# EasyEDA Pro project Frogduino Atmega1284 R2 EasyEDA Model.epro

# Schematic Schematic2
Board Name: PCB6; Create Date: 2026-05-09; Page Name: P1; Project Name: FrogduinoR2; Schematic Name: Schematic2; Update Date: 2026-05-13; Company: EasyEDA.com; Page Size: A4; Version: V1.0
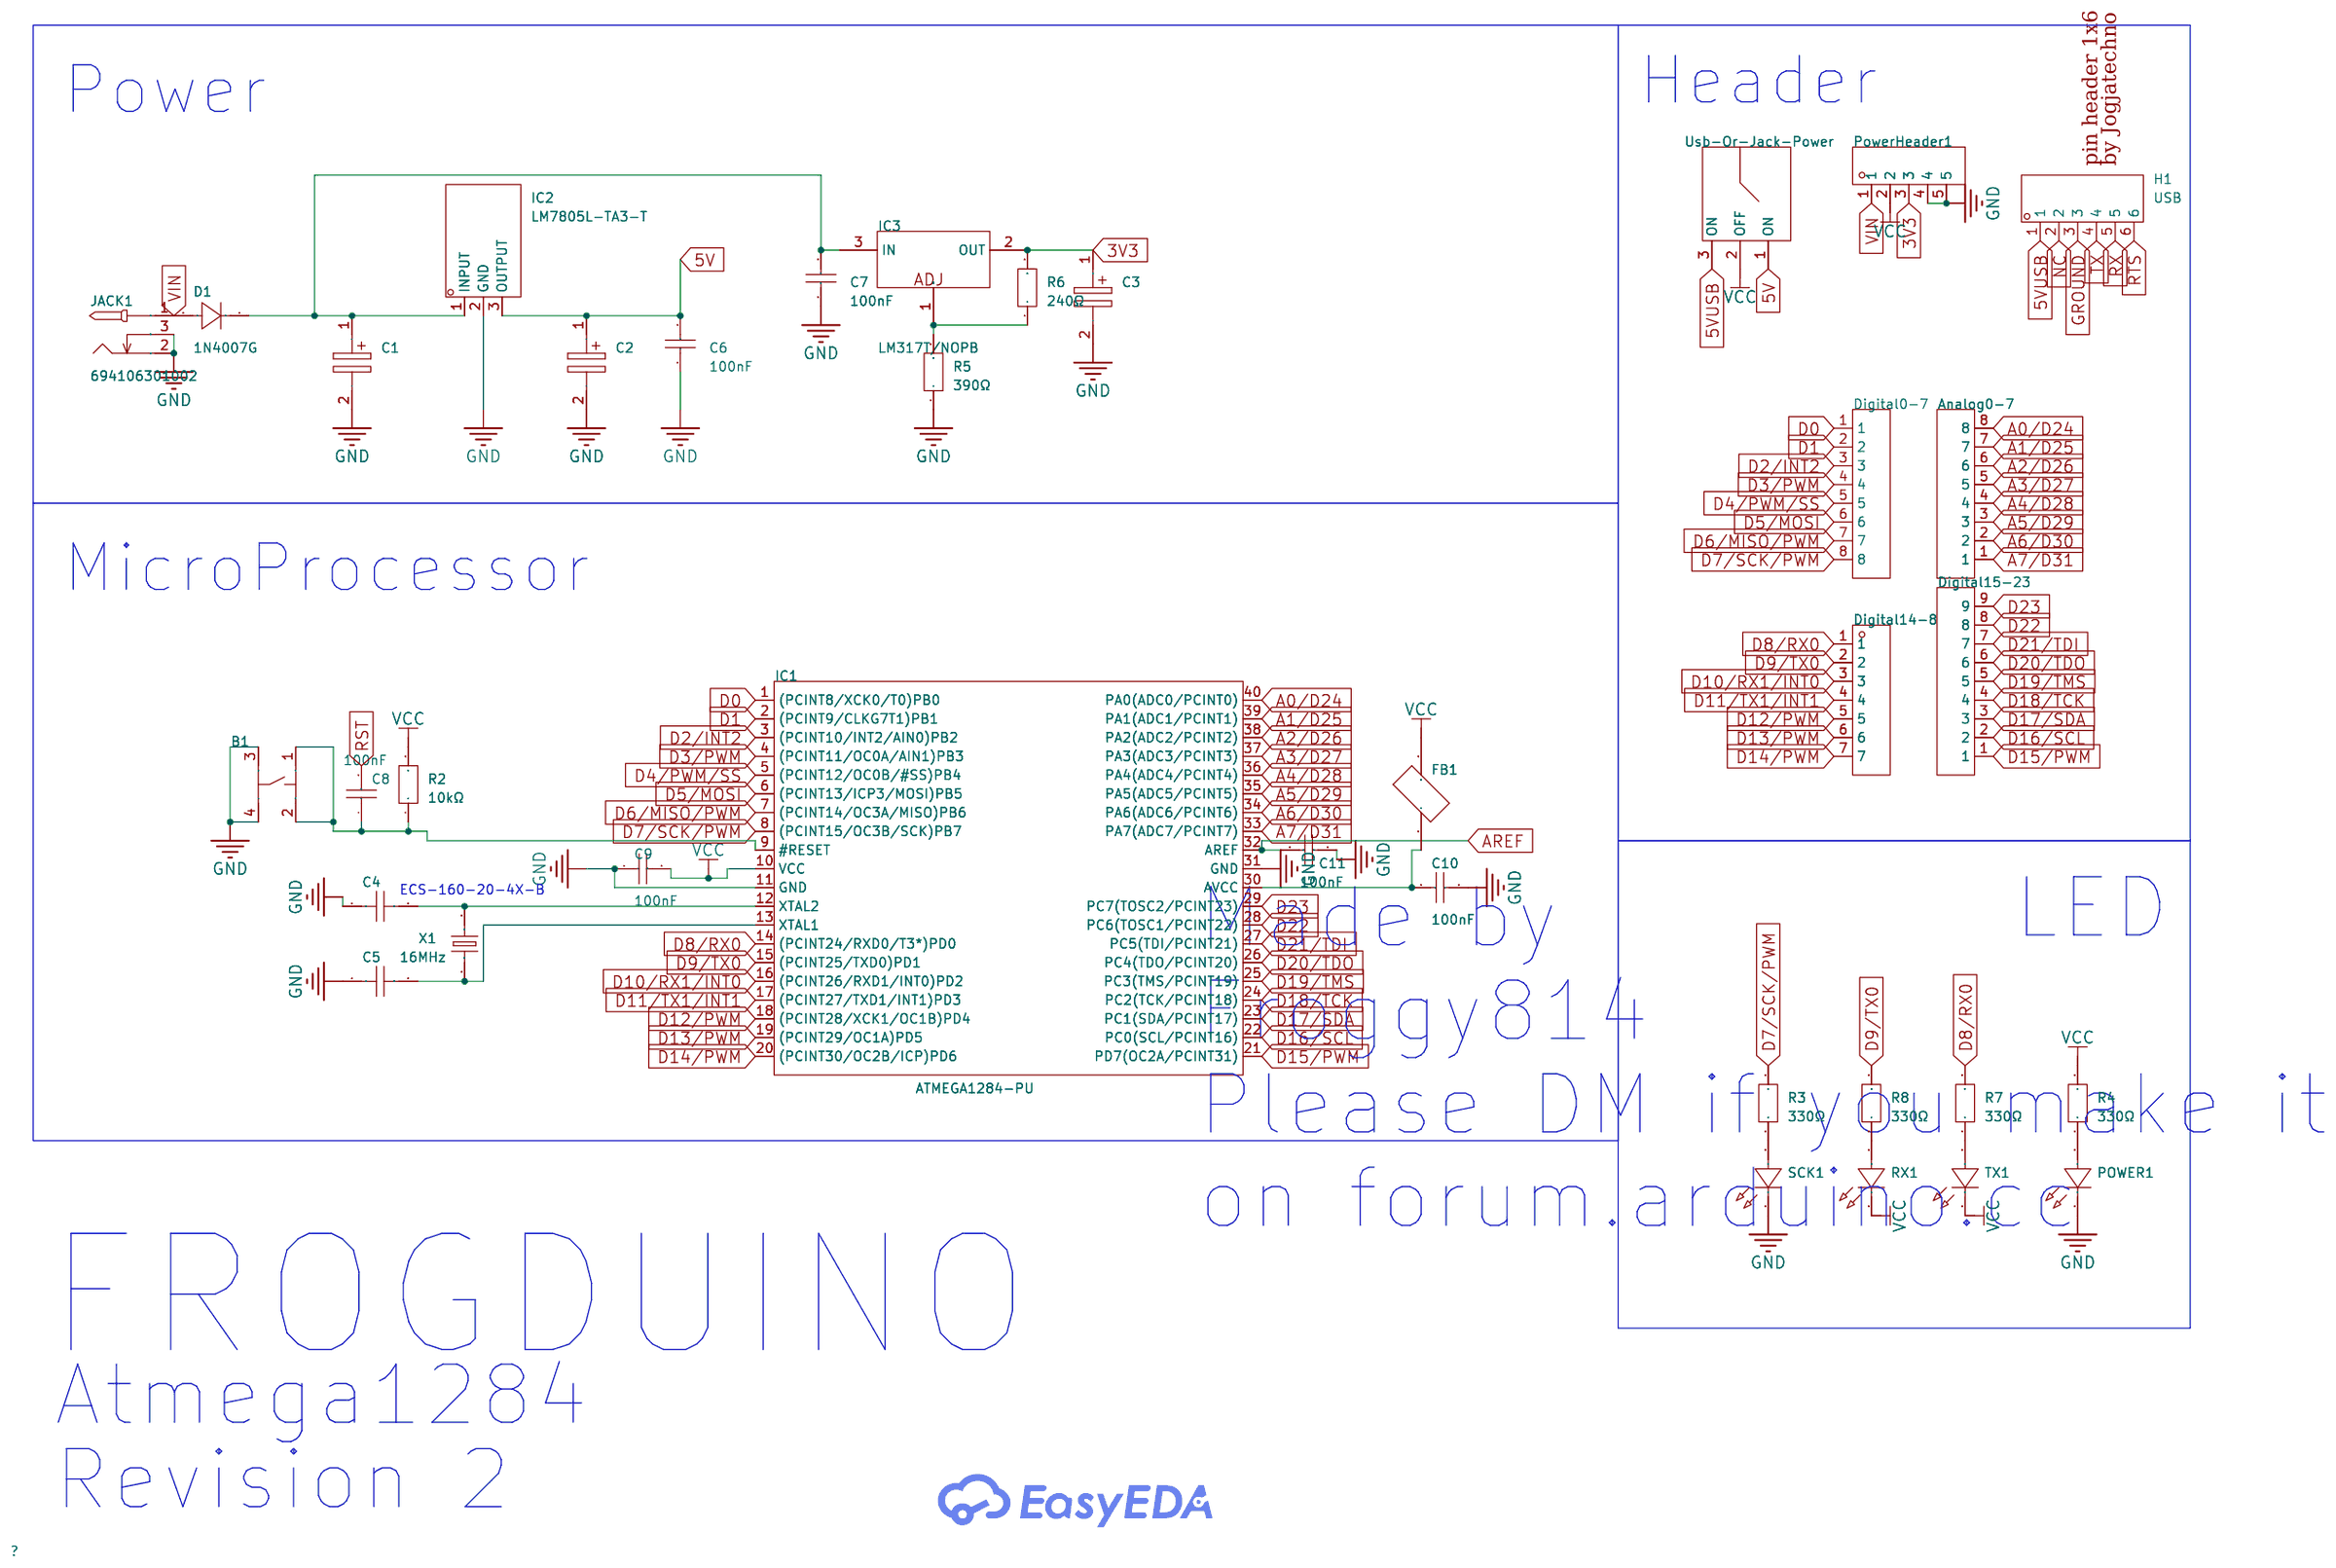
[diagram p0: schematic sheet]

## Parts
Analog0-7  排母HDR1X8-2.54  [HDR-TH_8P-P2.54-V-F]
B1  TS02-66-43-BK-100-SCR-D  [SW-TH_4P-L6.0-W6.0-P4.50-LS6.5]
C1  -  [CAPPM7344X310N]
C2  -  [CAPPM7344X310N]
C3  -  [CAPPM7344X310N]
C4  C0805C220J4HACTU  [C1210]
C5  C0805C220J4HACTU  [C1210]
C6  100nF  [C1206]
C7  100nF  [C1206]
C8  100nF  [C1206]
C9  100nF  [C1206]
C10  100nF  [C1206]
C11  100nF  [C1206]
D1  1N4007G  [DO-41_BD2.4-L4.7-P8.70-D0.6-RD]
Digital0-7  排母HDR1X8-2.54  [HDR-TH_8P-P2.54-V-F]
Digital14-8  2.54-1*7P/30mm(3+24+3)  [HDR-TH_7P-P2.54-V-M-1]
Digital15-23  KH-2.54PH180-1X9P-L11.5  [HDR-TH_9P-P2.54-V-M]
FB1  -  [FB_28L0138-70R-10]
H1  USB
IC1  ATMEGA1284-PU  [CONN-SMD_40P-P2.54_C9900007166]
IC2  LM7805L-TA3-T  [TO-220IS_L10.16-W4.7-P2.54-L]
IC3  LM317T/NOPB  [TO-220-3_L10.2-W4.6-P2.54-L]
JACK1  694106301002  [CONN-TH_694106301002]
POWER1  SML-811UTT86C  [LED-SMD_L3.4-W1.3-RD]
PowerHeader1  2.54mm1*5PHeader  [HDR-TH_5P-P2.54-V]
R2  10kΩ  [R2512]
R3  330Ω  [R2010]
R4  330Ω  [R2010]
R5  390Ω  [R2512]
R6  240Ω  [R2512]
R7  330Ω  [R2010]
R8  330Ω  [R2010]
RX1  SML-811UTT86C  [LED-SMD_L3.4-W1.3-RD]
SCK1  SML-811UTT86C  [LED-SMD_L3.4-W1.3-RD]
TX1  SML-811UTT86C  [LED-SMD_L3.4-W1.3-RD]
Usb-Or-Jack-Power  pu-mts-103 ON-OFF-ON  [SW-TH_MTS-103]
X1  16MHz  [HC-49US_L11.5-W4.5-P4.88]

## Library data of the parts
Analog0-7 Digital0-7 = 排母HDR1X8-2.54: Supplier Part: C9900015386; Supplier Footprint: HDR1X8-2.54; JLCPCB Part Class: Extended Part; Supplier: LCSC
B1 = TS02-66-43-BK-100-SCR-D: Circuit:SPST Actuator Style:Round Button Operating Force:1N Mounting Type:Through Hole Contact Current:50mA Voltage Rating:12V IP Rating:- Termination Style:PC Pin Life:100,000 Cycles Operating Temperature:-30℃~+80℃ Operating Temperature:-30℃~+80℃; Supplier Part: C4364877; Manufacturer: CUI; Supplier Footprint: 插件; JLCPCB Part Class: Extended Part; Datasheet: https://item.szlcsc.com/datasheet/TS02-66-43-BK-100-SCR-D/4935791.html; Supplier: LCSC; Circuit: SPST; Actuator Style: Round Button; Operating Force: 1N; Mounting Type: Through Hole; Contact Current: 50mA; Voltage Rating: 12V; Termination Style: PC Pin; Life: 100,000 Cycles; Operating Temperature: -30℃~+80℃
C1-C3 = TAJD107K016SNJV_
C4 C5 = C1210C220J5GACTU: Supplier Part: C22570112; Datasheet: https://atta.szlcsc.com/upload/public/pdf/source/20241203/850095265084969892AAA77F7FD49452.pdf; Supplier: LCSC
C6-C11 = 1206B104K101CT: Capacitance:100nF Tolerance:±10% Tolerance:±10% Voltage Rating:100V Temperature Coefficient:X7R; LCSC Part Name: 100nF ±10% 100V; Supplier Part: C77502; Manufacturer: Walsin(华新科); Supplier Footprint: 1206; JLCPCB Part Class: Extended Part; Datasheet: https://item.szlcsc.com/datasheet/1206B104K101CT/78631.html; Supplier: LCSC; Tolerance: ±10%; Voltage Rating: 100V; Temperature Coefficient: X7R
D1 = 1N4007G: Diode Configuration: Forward Voltage (Vf@If):1.1V@1A Reverse Voltage (Vr): Average Rectified Current (Io): Reverse Leakage Current:5uA@1kV; LCSC Part Name: 电压:1kV 电流:1A; Supplier Part: C2764732; Supplier Footprint: DO-41; JLCPCB Part Class: Extended Part; Supplier: LCSC; Forward Voltage (Vf@If): 1.1V@1A; Reverse Leakage Current: 5uA@1kV
Digital14-8 = 2.54-1*7P/30mm(3+24+3): Supplier Part: C9900034497; Supplier Footprint: 2.54-1x7P; JLCPCB Part Class: Extended Part; Supplier: LCSC
Digital15-23 = KH-2.54PH180-1X9P-L11.5: Pin Structure:1x9P Pitch:2.54mm Row Spacing:- Circluar Pins/Square Pins:Policy Mounting Type:Straight Number of Rows:Single Row Number of Pins:9P Current Rating:3A Voltage Rating (Max):- Length of Mating Pin:6mm Insulation Height:2.5mm Length of End Conne; LCSC Part Name: 1x9P 间距:2.54mm 方针 直插; Supplier Part: C2932701; Manufacturer: kinghelm(金航标); Supplier Footprint: 插件,P=2.54mm; JLCPCB Part Class: Extended Part; Datasheet: https://atta.szlcsc.com/upload/public/pdf/source/20211220/F957F65180C658B5F5CB9573E63AB667.pdf; Supplier: LCSC; Pin Structure: 1x9P; Pitch: 2.54mm; Circluar Pins/Square Pins: Policy; Mounting Type: Straight; Number of Rows: Single Row; Number of Pins: 9P; Current Rating: 3A; Length of Mating Pin: 6mm; Insulation Height: 2.5mm; Length of End Connection Pin: 3mm; Operating Temperature: -40℃~+105℃; Color: Black
FB1 = 28L0138-70R-10_
H1 = Headers  Pins1x6P 2.54mm: Supplier Part: C54102; Supplier: LCSC; Manufacturer: ReliaPro; image: http://image.lceda.cn/szlcsc/C54102.jpg
IC1 = ATMEGA1284-PU: CPU Core:AVR CPU Maximum Speed:20MHz Program Storage Size:128KB Program Memory Type:FLASH EEPROM:4KB Number of I/O:32 ADC (Bit):10bit Voltage - Supply:1.8V~5.5V Voltage - Supply:1.8V~5.5V Applications:-; Supplier Part: C1341589; Manufacturer: MICROCHIP(美国微芯); Supplier Footprint: PDIP-40; Datasheet: https://atta.szlcsc.com/upload/public/pdf/source/20210630/C1341589_4A9698A644C701E681E776C28A22DCFA.pdf; Supplier: LCSC; CPU Core: AVR; CPU Maximum Speed: 20MHz; Program Storage Size: 128KB; Program Memory Type: FLASH; EEPROM: 4KB; Number of I/O: 32; ADC (Bit): 10bit; Voltage - Supply: 1.8V~5.5V
IC2 = LM7805L-TA3-T: Output Type:-; Supplier Part: C340686; Supplier Footprint: TO-220IS; JLCPCB Part Class: Extended Part; Supplier: LCSC
IC3 = LM317T/NOPB: Output Type:Adjustable Voltage - Supply:40V Output Voltage:1.25V~37V Output Voltage:1.25V~37V Output Current:1.5A Power Supply Rejection Ratio (PSRR):80dB@(120Hz) Voltage Dropout:- standby current:50uA Noise:- Features:Over Current Protection；Short Circui; LCSC Part Name: 1.25V~37V 1.5A 40V; Supplier Part: C2870516; Manufacturer: TI(德州仪器); Supplier Footprint: TO-220; JLCPCB Part Class: Extended Part; Datasheet: https://www.ti.com/cn/lit/gpn/lm117; Supplier: LCSC; Output Type: Adjustable; Voltage - Supply: 40V; Output Voltage: 1.25V~37V; Output Current: 1.5A; Power Supply Rejection Ratio (PSRR): 80dB@(120Hz); standby current: 50uA; Features: Over Current Protection；Short Circuit Protection；Over Temperature Protection; Operating Temperature: 0℃~+125℃@(Tj); Output Configuration: Positive; Number of Outputs: 1
JACK1 = 694106301002: link: https://cn.bing.com/search?q=datasheet： 694106301002; Supplier: Digi-Key; Supplier Part: C9900003330; JLCPCB Part Class: Extended Part; Manufacturer: würth Elektronik
POWER1 RX1 SCK1 TX1 = SML-811UTT86C: Illumination Color:Red Voltage - Forward(Vf):1.95V Voltage - Forward(Vf):1.95V Forward Current:10mA Wavelength - Dominant:620nm Wavelength - Dominant:620nm Lens Color:Water Clear Luminous Intensity:22.4mcd Luminous Intensity:22.4mcd; Supplier Part: C5924201; Manufacturer: ROHM(罗姆); Supplier Footprint: SMD,3.4x1.3mm; JLCPCB Part Class: Extended Part; Datasheet: https://item.szlcsc.com/datasheet/SML-811UTT86C/6861401.html; Supplier: LCSC; Illumination Color: Red; Voltage - Forward(Vf): 1.95V; Forward Current: 10mA; Wavelength - Dominant: 620nm; Lens Color: Water Clear; Luminous Intensity: 22.4mcd
PowerHeader1 = 2.54mm 1*5P Header: Supplier Part: C50951; Supplier: LCSC; Manufacturer: ReliaPro; image: http://image.lceda.cn/szlcsc/C50951.jpg
R2 = AS25J1002ET: Type:Thick Film Resistor Resistance:10kΩ Tolerance:±5% Tolerance:±5% Power(Watts):1.5W Temperature Coefficient:±100ppm/℃ Temperature Coefficient:±100ppm/℃ Operating Temperature:-55℃~+155℃ Operating Temperature:-55℃~+155℃; LCSC Part Name: 厚膜电阻 10kΩ ±5% 1.5W; Supplier Part: C3954599; Manufacturer: Ohmite; Supplier Footprint: 2512; Datasheet: https://item.szlcsc.com/datasheet/AS25J1002ET/4523159.html; Supplier: LCSC; Type: Thick Film Resistor; Tolerance: ±5%; Power(Watts): 1.5W; Temperature Coefficient: ±100ppm/℃; Operating Temperature: -55℃~+155℃
R3 R4 R7 R8 = RC2010JK-07330RL: Type:Thick Film Resistors Resistance: Tolerance:±5% Tolerance:±5% Power(Watts): Overload Voltage (Max): Temperature Coefficient:±100ppm/℃ Temperature Coefficient:±100ppm/℃ Operating Temperature Range:-55℃~+155℃ Operating Temperature Range:-55℃~+155℃; LCSC Part Name: 厚膜电阻 330Ω ±5% 750mW; Supplier Part: C375684; Manufacturer: YAGEO(国巨); Supplier Footprint: 2010; JLCPCB Part Class: Extended Part; Datasheet: https://atta.szlcsc.com/upload/public/pdf/source/20190227/C375684_4A58F674F4E48E69DECCBC420C92B96E.pdf; Supplier: LCSC; Type: Thick Film Resistors; Tolerance: ±5%; Temperature Coefficient: ±100ppm/℃; Operating Temperature Range: -55℃~+155℃
R5 = CRGP2512F390R: Type:Thick Film Resistors Resistance: Tolerance:±1% Tolerance:±1% Power(Watts): Temperature Coefficient:±100ppm/℃ Temperature Coefficient:±100ppm/℃ Operating Temperature Range:-55℃~+155℃ Operating Temperature Range:-55℃~+155℃; LCSC Part Name: 厚膜电阻 390Ω ±1% 2W; Supplier Part: C4323717; Manufacturer: TE Connectivity(泰科电子); Supplier Footprint: 2512; Supplier: LCSC; Type: Thick Film Resistors; Tolerance: ±1%; Temperature Coefficient: ±100ppm/℃; Operating Temperature Range: -55℃~+155℃
R6 = RK73H3ATTE2400F: Type:Thick Film Resistor Resistance:240Ω Tolerance:±1% Tolerance:±1% Power(Watts):1W Temperature Coefficient:±100ppm/℃ Temperature Coefficient:±100ppm/℃ Operating Temperature:-55℃~+155℃ Operating Temperature:-55℃~+155℃; LCSC Part Name: 厚膜电阻 240Ω ±1% 1W; Supplier Part: C346146; Manufacturer: KOA; Supplier Footprint: 2512; Datasheet: https://item.szlcsc.com/datasheet/RK73H3ATTE2400F/322812.html; Supplier: LCSC; Type: Thick Film Resistor; Tolerance: ±1%; Power(Watts): 1W; Temperature Coefficient: ±100ppm/℃; Operating Temperature: -55℃~+155℃
Usb-Or-Jack-Power = pu-mts-103 ON-OFF-ON: Supplier Part: C9900183726; Supplier Footprint: Through hole; JLCPCB Part Class: Extended Part; Supplier: LCSC
X1 = XIHCELNANF-16MHZ: Type:Through-Hole Crystal Oscillator Frequency:16MHz Normal temperature Frequency Tolerance:±30ppm Normal temperature Frequency Tolerance:±30ppm Load Capacitance:20pF Frequency Stability:±30ppm Frequency Stability:±30ppm Operating Temperature:-40℃~+85℃ Op; LCSC Part Name: 16MHz ±30ppm 20pF; Supplier Part: C295075; Manufacturer: TAITIEN(泰艺电子); Supplier Footprint: HC-49S; JLCPCB Part Class: Extended Part; Datasheet: https://atta.szlcsc.com/upload/public/pdf/source/20190107/C358649_B3943D1FEB8737E4FCE005A191A94016.pdf; Supplier: LCSC; Type: Through-Hole Crystal Oscillator; Normal temperature Frequency Tolerance: ±30ppm; Load Capacitance: 20pF; Frequency Stability: ±30ppm; Operating Temperature: -40℃~+85℃

## Nets
3V3: C3.1(+) IC3.2(OUT) PowerHeader1.3 R6.2
5V: C2.1(+) C6.2 IC2.3(OUTPUT) Usb-Or-Jack-Power.1(ON)
5VUSB: H1.1 Usb-Or-Jack-Power.3(ON)
GND: B1.3 B1.4 C1.2(-) C2.2(-) C3.2(-) C4.1 C5.1 C6.1 C7.1 C9.1 C10.2 C11.2 IC1.11(GND) IC1.31(GND) IC2.2(GND) JACK1.2 JACK1.3 POWER1.1(K) PowerHeader1.4 PowerHeader1.5 R5.1 SCK1.1(K)
VCC: C9.2 FB1.2 IC1.10(VCC) PowerHeader1.2 R2.2 R4.2 RX1.1(K) TX1.1(K) Usb-Or-Jack-Power.2(OFF)
VIN: D1.2(A) JACK1.1 PowerHeader1.1
A0/D24: Analog0-7.8 IC1.40(PA0(ADC0/PCINT0))
A1/D25: Analog0-7.7 IC1.39(PA1(ADC1/PCINT1))
A2/D26: Analog0-7.6 IC1.38(PA2(ADC2/PCINT2))
A3/D27: Analog0-7.5 IC1.37(PA3(ADC3/PCINT3))
A4/D28: Analog0-7.4 IC1.36(PA4(ADC4/PCINT4))
A5/D29: Analog0-7.3 IC1.35(PA5(ADC5/PCINT5))
A6/D30: Analog0-7.2 IC1.34(PA6(ADC6/PCINT6))
A7/D31: Analog0-7.1 IC1.33(PA7(ADC7/PCINT7))
AREF: C11.1 IC1.32(AREF)
D0: Digital0-7.1 IC1.1((PCINT8/XCK0/T0)PB0)
D1: Digital0-7.2 IC1.2((PCINT9/CLKG7T1)PB1)
D2/INT2: Digital0-7.3 IC1.3((PCINT10/INT2/AIN0)PB2)
D3/PWM: Digital0-7.4 IC1.4((PCINT11/OC0A/AIN1)PB3)
D4/PWM/SS: Digital0-7.5 IC1.5((PCINT12/OC0B/#SS)PB4)
D5/MOSI: Digital0-7.6 IC1.6((PCINT13/ICP3/MOSI)PB5)
D6/MISO/PWM: Digital0-7.7 IC1.7((PCINT14/OC3A/MISO)PB6)
D7/SCK/PWM: Digital0-7.8 IC1.8((PCINT15/OC3B/SCK)PB7) R3.2
D8/RX0: Digital14-8.1 IC1.14((PCINT24/RXD0/T3*)PD0) R7.2
D9/TX0: Digital14-8.2 IC1.15((PCINT25/TXD0)PD1) R8.2
D10/RX1/INT0: Digital14-8.3 IC1.16((PCINT26/RXD1/INT0)PD2)
D11/TX1/INT1: Digital14-8.4 IC1.17((PCINT27/TXD1/INT1)PD3)
D12/PWM: Digital14-8.5 IC1.18((PCINT28/XCK1/OC1B)PD4)
D13/PWM: Digital14-8.6 IC1.19((PCINT29/OC1A)PD5)
D14/PWM: Digital14-8.7 IC1.20((PCINT30/OC2B/ICP)PD6)
D15/PWM: Digital15-23.1 IC1.21(PD7(OC2A/PCINT31))
D16/SCL: Digital15-23.2 IC1.22(PC0(SCL/PCINT16))
D17/SDA: Digital15-23.3 IC1.23(PC1(SDA/PCINT17))
D18/TCK: Digital15-23.4 IC1.24(PC2(TCK/PCINT18))
D19/TMS: Digital15-23.5 IC1.25(PC3(TMS/PCINT19))
D20/TDO: Digital15-23.6 IC1.26(PC4(TDO/PCINT20))
D21/TDI: Digital15-23.7 IC1.27(PC5(TDI/PCINT21))
D22: Digital15-23.8 IC1.28(PC6(TOSC1/PCINT22))
D23: Digital15-23.9 IC1.29(PC7(TOSC2/PCINT23))
GROUND: H1.3
NC: H1.2
RST: C8.2
RTS: H1.6
RX: H1.5
TX: H1.4
Net-(B1-1): B1.1 B1.2 C8.1 IC1.9(#RESET) R2.1
Net-(C1-1): C1.1(+) C7.2 D1.1(K) IC2.1(INPUT) IC3.3(IN)
Net-(C4-2): C4.2 IC1.12(XTAL2) X1.2
Net-(C5-2): C5.2 IC1.13(XTAL1) X1.1
Net-(C10-1): C10.1 FB1.1 IC1.30(AVCC)
Net-(IC3-1): IC3.1(ADJ) R5.2 R6.1
Net-(POWER1-2): POWER1.2(A) R4.1
Net-(R3-1): R3.1 SCK1.2(A)
Net-(R7-1): R7.1 TX1.2(A)
Net-(R8-1): R8.1 RX1.2(A)

## Notes on the sheet
- Power
- Header
- MicroProcessor
- ECS-160-20-4X-B
- LED
- Made by
  Froggy814
  Please DM if you make it
  on forum.arduino.cc
- FROGDUINO
- Atmega1284
- Revision 2

# Board PCB6
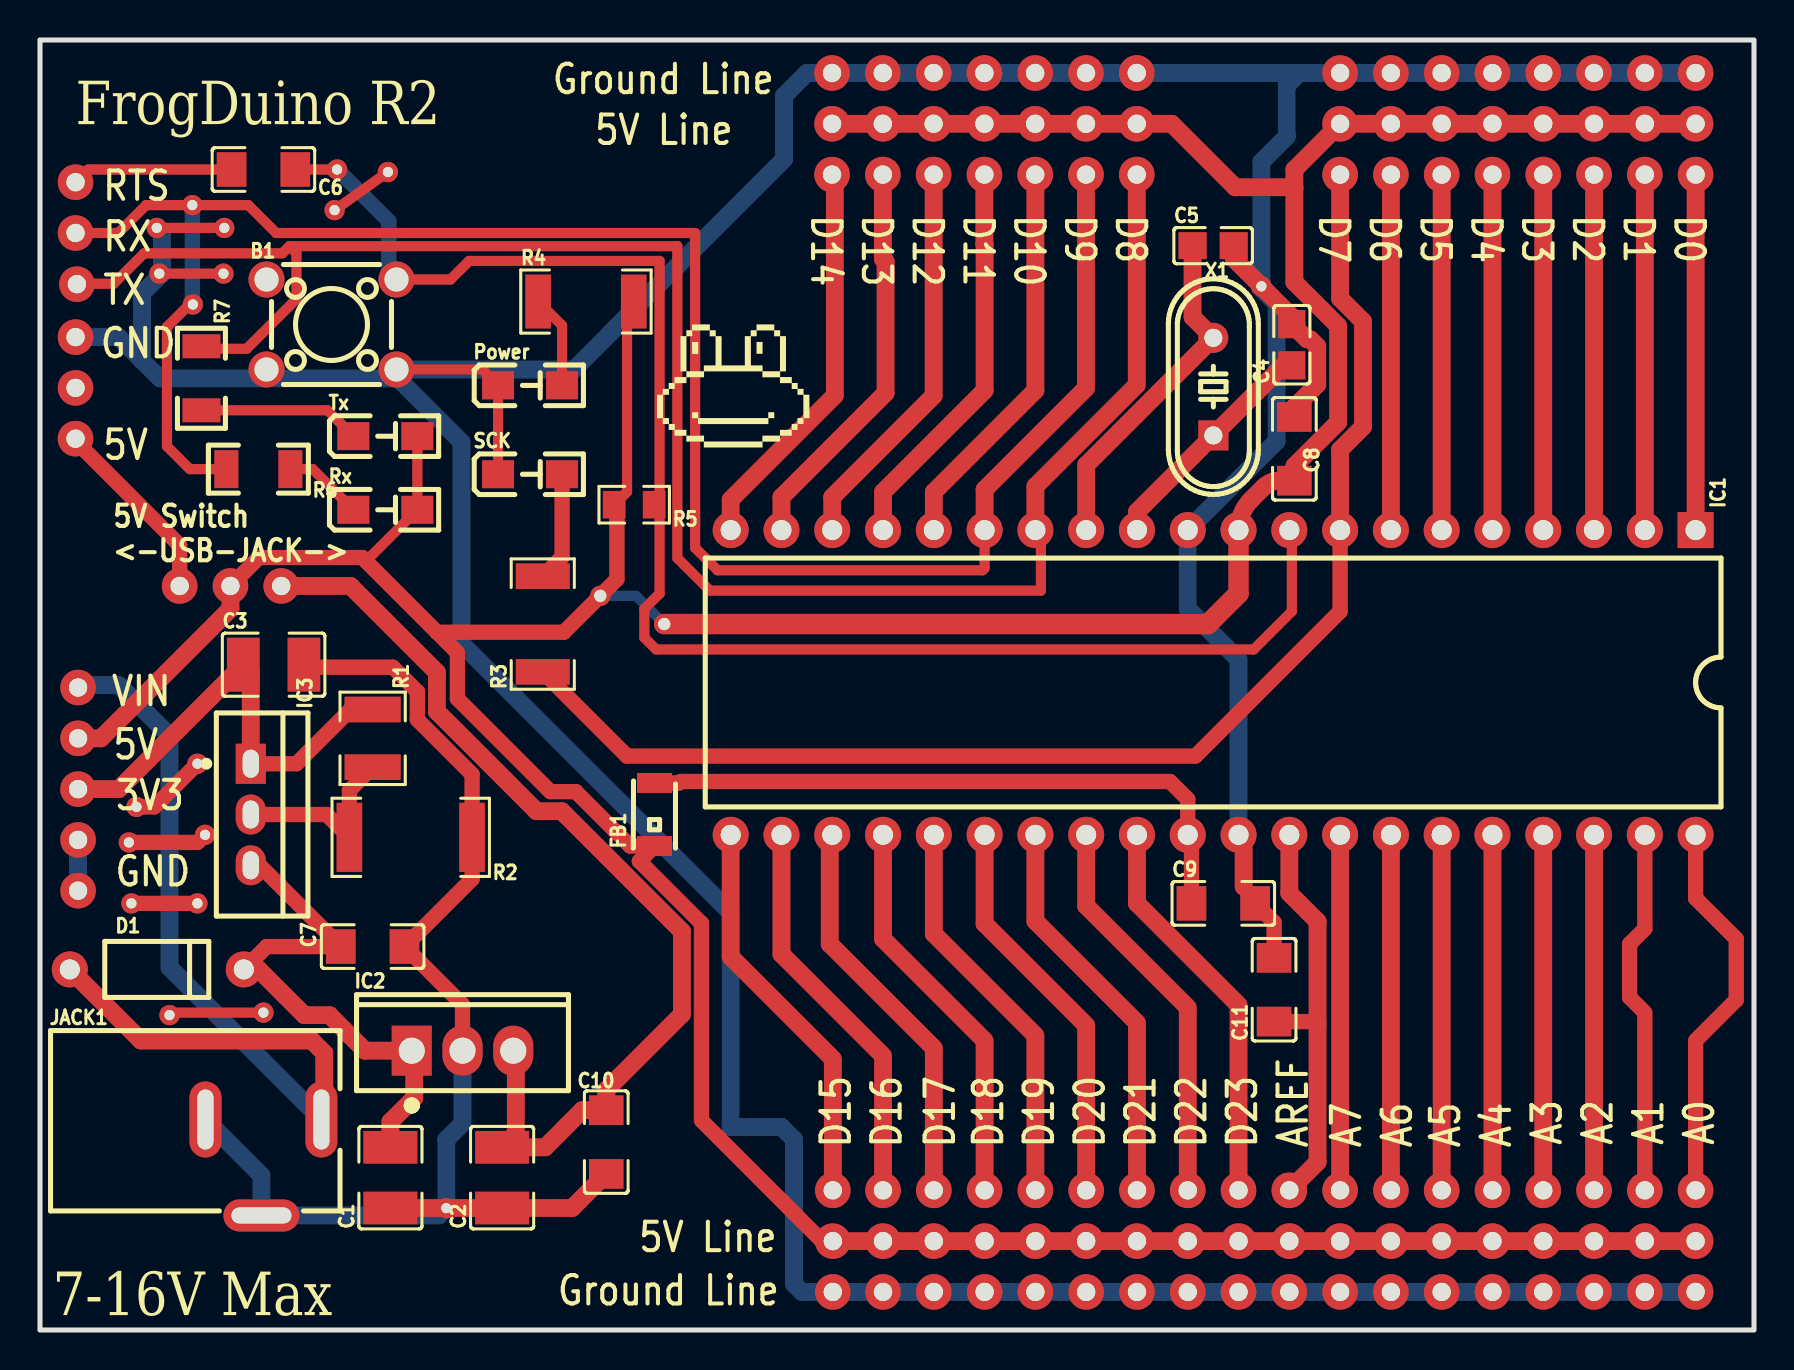
[diagram p1: board, top side]
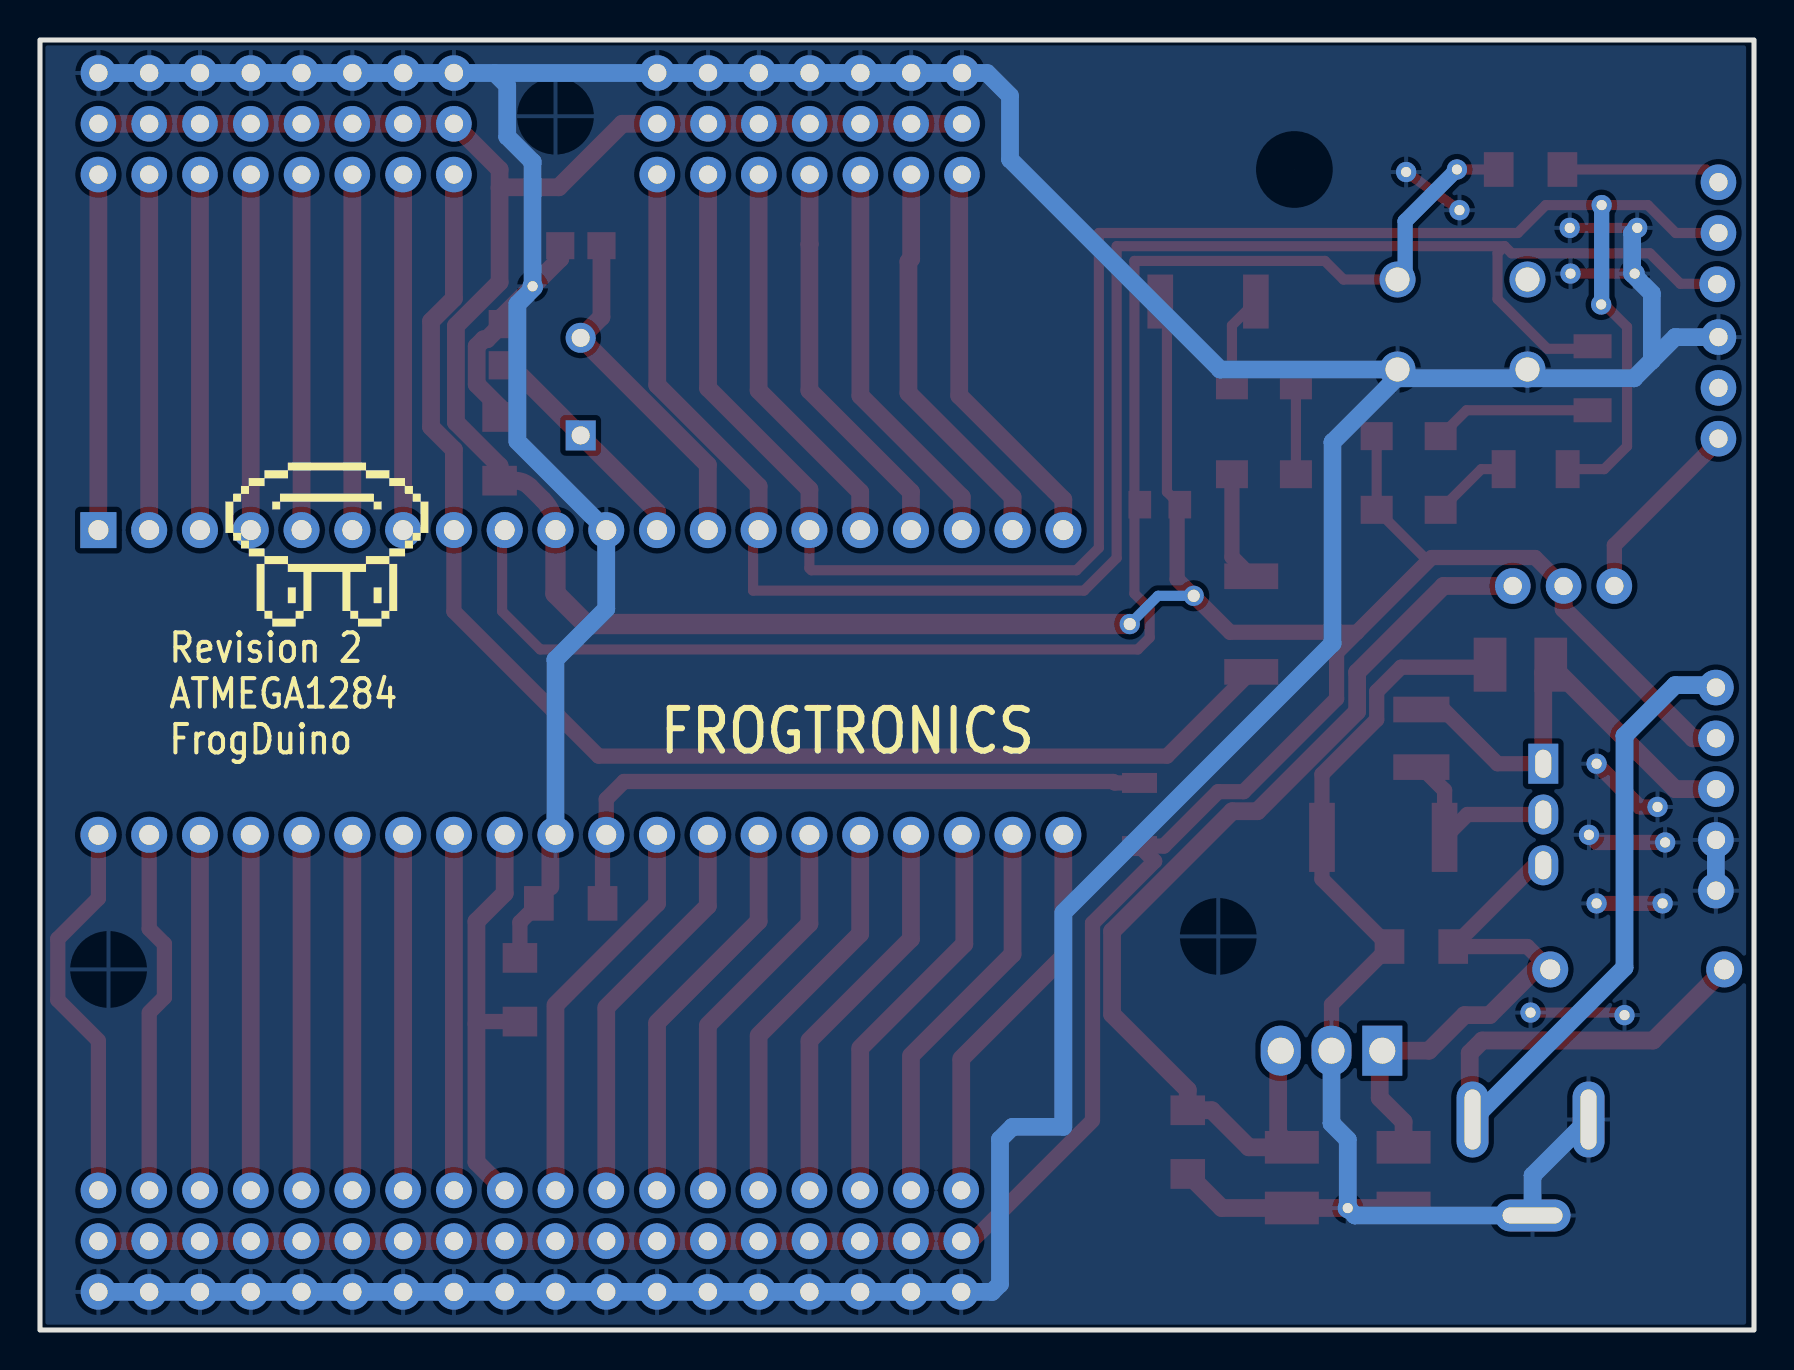
[diagram p2: board, bottom side, seen from below]

Outline 85.72 x 64.52 mm; copper layers: Top Layer, Bottom Layer. Coordinates in mm from the lower left corner of the outline.
Outline path: rectangle 0,64.52 85.72,0
Stack: Top Layer 0.035mm / Dielectric1 1.51mm FR4 er 4.5 / Bottom Layer 0.035mm

## Design rules (mm)
template: Custom Config
spacing copperThickness1oz (default): track to track 0.152, other pairs 0.152 to 0.3
spacing copperThickness2oz: track to track 0.203, other pairs 0.152 to 0.3
track width copperThickness1oz (default): min 0.254, default 0.508, max 5.08
track width copperThickness2oz: min 0.203, default 0.254, max 2.54
differential pair differentialPair (default): width min 0.127, default 0.254, max 2.54; gap min 0.152, default 0.152
via viaSize (default): diameter min 0.508, default 1.016, max 15.24; hole min 0.254, default 0.508, max 10.16

## Placement (name value [footprint] x y rotation side)
B1  TS02-66-43-BK-100-SCR-D  [SW-TH_4P-L6.0-W6.0-P4.50-LS6.5]  14.58 50.29 0 top
C1  -  [C1210]  17.53 7.62 90 top
C2  -  [C1210]  23.11 7.62 90 top
C3  -  [C1210]  11.68 33.27 0 top
C4  C0805C220J4HACTU  [C0805]  62.61 49.28 90 top
C5  C0805C220J4HACTU  [C0805]  58.67 54.23 0 top
C6  100nF  [C1206]  11.18 58.04 180 top
C7  100nF  [C1206]  16.64 19.18 180 top
C8  100nF  [C1206]  62.74 44.07 90 top
C9  100nF  [C1206]  59.18 21.34 0 top
C10  100nF  [C1206]  28.32 9.4 90 top
C11  100nF  [C1206]  61.72 17.02 90 top
D1  1N4007G  [DO-41_BD2.4-L4.7-P8.70-D0.9-RD]  5.84 18.03 180 top
FB1  2450AT18A100E  [ANT-SMD_L3.2-W1.6]  30.73 25.78 90 top
IC1  ATMEGA1284-PU  [PDIP-40_L52.3-W13.8-P2.54-LS15.2-BL]  58.67 32.38 180 top
IC2  LM7805L-TA3-T  [TO-220IS_L10.16-W4.7-P2.54-L]  21.13 13.97 0 top
IC3  LM317T/NOPB  [TO-220-3_L10.2-W4.6-P2.54-L]  10.54 25.78 270 top
JACK1  694106301002  [DC-IN-TH_694106301002]  11.18 8.13 0 top
NOREF  -  [Pad_e180]  22.99 58.04 0 top
NOREF#2  -  [Pad_e1841]  65.02 4.44 0 top
NOREF#3  -  [Pad_e1862]  75.18 1.91 0 top
NOREF#4  -  [Pad_e1842]  67.56 4.44 0 top
NOREF#5  -  [Pad_e6892]  28.02 36.72 0 top
NOREF#6  -  [Pad_e1855]  57.4 1.91 0 top
NOREF#7  -  [Pad_e2027]  67.56 62.86 0 top
NOREF#8  -  [Pad_e8725]  82.3 18.03 0 top
NOREF#9  -  [Pad_e15]  75.18 57.78 0 top
NOREF#10  -  [Pad_e2016]  77.72 60.32 0 top
NOREF#11  -  [Pad_e2022]  47.23 62.86 0 top
NOREF#12  -  [Pad_e435]  6.98 37.21 90 top
NOREF#13  -  [Pad_e1847]  80.26 4.44 0 top
NOREF#14  -  [Pad_e55]  54.86 6.98 0 top
NOREF#15  -  [Pad_e1607]  7.64 51.29 0 top
NOREF#16  -  [Pad_e14]  77.72 57.78 0 top
NOREF#17  -  [Pad_e48]  80.26 6.98 0 top
NOREF#18  -  [Pad_e5832]  8.25 24.76 0 top
NOREF#19  -  [Pad_e1863]  77.72 1.91 0 top
NOREF#20  -  [Pad_e2028]  70.1 62.86 0 top
NOREF#21  -  [Pad_e342]  39.61 57.78 0 top
NOREF#22  -  [Pad_e1865]  82.8 1.91 0 top
NOREF#23  -  [Pad_e46]  75.18 6.98 0 top
NOREF#24  -  [Pad_e1839]  59.94 4.44 0 top
NOREF#25  -  [Pad_e2010]  54.85 60.32 0 top
NOREF#26  -  [Pad_e1623]  20.32 6.1 0 top
NOREF#27  -  [Pad_e43]  70.1 6.98 0 top
NOREF#28  -  [Pad_e1849]  42.16 1.91 0 top
NOREF#29  -  [Pad_e56]  52.32 6.98 0 top
NOREF#30  -  [Pad_e1557]  61.09 52.2 0 top
NOREF#31  -  [Pad_e6450]  59.94 60.71 0 top
NOREF#32  -  [Pad_e5833]  7.87 21.34 0 top
NOREF#33  -  [Pad_e7904]  11.18 15.87 0 top
NOREF#34  -  [Pad_e1845]  75.18 4.44 0 top
NOREF#35  -  [Pad_e1843]  70.1 4.44 0 top
NOREF#36  -  [Pad_e744]  1.85 52.3 90 top
NOREF#37  -  [Pad_e2009]  52.31 60.32 0 top
NOREF#38  -  [Pad_e2023]  49.77 62.86 0 top
NOREF#39  -  [Pad_e290]  1.78 49.66 90 top
NOREF#40  -  [Pad_e2005]  42.15 60.32 0 top
NOREF#41  -  [Pad_e2004]  39.61 60.32 0 top
NOREF#42  -  [Pad_e54]  57.4 6.98 0 top
NOREF#43  -  [Pad_e1846]  77.72 4.44 0 top
NOREF#44  -  [Pad_e2013]  70.1 60.32 0 top
NOREF#45  -  [Pad_e1603]  5.84 55.12 0 top
NOREF#46  -  [Pad_e59]  44.7 6.98 0 top
NOREF#47  -  [Pad_e1860]  70.1 1.91 0 top
NOREF#48  -  [Pad_e2030]  75.18 62.86 0 top
NOREF#49  -  [Pad_e291]  1.78 47.12 90 top
NOREF#50  -  [Pad_e676]  1.78 44.58 0 top
NOREF#51  -  [Pad_e1858]  65.02 1.91 0 top
NOREF#52  -  [Pad_e725]  1.78 57.4 90 top
NOREF#53  -  [Pad_e38]  65.02 6.98 0 top
NOREF#54  -  [Pad_e2006]  44.69 60.32 0 top
NOREF#55  -  [Pad_e13]  80.26 57.78 0 top
NOREF#56  -  [Pad_e433]  12.06 37.21 90 top
NOREF#57  -  [Pad_e2029]  72.64 62.86 0 top
NOREF#58  -  [Pad_e2008]  49.77 60.32 0 top
NOREF#59  -  [Pad_e2018]  82.8 60.32 0 top
NOREF#60  -  [Pad_e58]  47.24 6.98 0 top
NOREF#61  -  [Pad_e4619]  1.9 32.13 270 top
NOREF#62  -  [Pad_e9009]  14.86 58.04 0 top
NOREF#63  -  [Pad_e1837]  54.86 4.44 0 top
NOREF#64  -  [Pad_e1864]  80.26 1.91 0 top
NOREF#65  -  [Pad_e47]  77.72 6.98 0 top
NOREF#66  -  [Pad_e1832]  42.16 4.44 0 top
NOREF#67  -  [Pad_e434]  9.52 37.21 90 top
NOREF#68  -  [Pad_e4618]  1.9 29.59 270 top
NOREF#69  -  [Pad_e1852]  49.78 1.91 0 top
NOREF#70  -  [Pad_e2026]  65.02 62.86 0 top
NOREF#71  -  [Pad_e1859]  67.56 1.91 0 top
NOREF#72  -  [Pad_e53]  59.94 6.98 0 top
NOREF#73  -  [Pad_e1602]  5.97 52.83 0 top
NOREF#74  -  [Pad_e2032]  80.26 62.86 0 top
NOREF#75  -  [Pad_e1844]  72.64 4.44 0 top
NOREF#76  -  [Pad_e723]  1.78 54.86 90 top
NOREF#77  -  [Pad_e340]  44.69 57.78 0 top
NOREF#78  -  [Pad_e339]  47.23 57.78 0 top
NOREF#79  -  [Pad_e45]  72.64 6.98 0 top
NOREF#80  -  [Pad_e1856]  59.94 1.91 0 top
NOREF#81  -  [Pad_e1601]  9.18 52.83 0 top
NOREF#82  -  [Pad_e60]  42.16 6.98 0 top
NOREF#83  -  [Pad_e1833]  44.7 4.44 0 top
NOREF#84  -  [Pad_e2024]  52.31 62.86 0 top
NOREF#85  -  [Pad_e41]  67.56 6.98 0 top
NOREF#86  -  [Pad_e1605]  7.62 56.26 0 top
NOREF#87  -  [Pad_e2011]  65.02 60.32 0 top
NOREF#88  -  [Pad_e12]  82.8 57.78 0 top
NOREF#89  -  [Pad_e1835]  49.78 4.44 0 top
NOREF#90  -  [Pad_e2017]  80.26 60.32 0 top
NOREF#91  -  [Pad_e341]  42.15 57.78 0 top
NOREF#92  -  [Pad_e4616]  1.9 24.51 270 top
NOREF#93  -  [Pad_e1850]  44.7 1.91 0 top
NOREF#94  -  [Pad_e337]  52.31 57.78 0 top
NOREF#95  -  [Pad_e336]  54.85 57.78 0 top
NOREF#96  -  [Pad_e52]  62.48 6.98 0 top
NOREF#97  -  [Pad_e1851]  47.24 1.91 0 top
NOREF#98  -  [Pad_e2014]  72.64 60.32 0 top
NOREF#99  -  [Pad_e5834]  4.57 21.34 0 top
NOREF#100  -  [Pad_e1854]  54.86 1.91 0 top
NOREF#101  -  [Pad_e4617]  1.9 27.05 270 top
NOREF#102  -  [Pad_e2007]  47.23 60.32 0 top
NOREF#103  -  [Pad_e49]  82.8 6.98 0 top
NOREF#104  -  [Pad_e5836]  4.83 26.16 0 top
NOREF#105  -  [Pad_e1853]  52.32 1.91 0 top
NOREF#106  -  [Pad_e18]  67.56 57.78 0 top
NOREF#107  -  [Pad_e2021]  44.69 62.86 0 top
NOREF#108  -  [Pad_e1834]  47.24 4.44 0 top
NOREF#109  -  [Pad_e7903]  6.48 15.75 0 top
NOREF#110  -  [Pad_e2031]  77.72 62.86 0 top
NOREF#111  -  [Pad_e9017]  17.4 57.91 0 top
NOREF#112  -  [Pad_e2033]  82.8 62.86 0 top
NOREF#113  -  [Pad_e1848]  82.8 4.44 0 top
NOREF#114  -  [Pad_e1840]  62.48 4.44 0 top
NOREF#115  -  [Pad_e113]  39.65 4.44 0 top
NOREF#116  -  [Pad_e1838]  57.4 4.44 0 top
NOREF#117  -  [Pad_e6891]  31.22 35.31 0 top
NOREF#118  -  [Pad_e1604]  9.22 55.12 0 top
NOREF#119  -  [Pad_e1857]  62.48 1.91 0 top
NOREF#120  -  [Pad_e4615]  1.9 21.97 270 top
NOREF#121  -  [Pad_e16]  72.64 57.78 0 top
NOREF#122  -  [Pad_e112]  39.65 6.98 0 top
NOREF#123  -  [Pad_e9016]  14.73 56.01 0 top
NOREF#124  -  [Pad_e19]  65.02 57.78 0 top
NOREF#125  -  [Pad_e338]  49.77 57.78 0 top
NOREF#126  -  [Pad_e2019]  39.61 62.86 0 top
NOREF#127  -  [Pad_e5831]  7.87 28.32 0 top
NOREF#128  -  [Pad_e1836]  52.32 4.44 0 top
NOREF#129  -  [Pad_e2025]  54.85 62.86 0 top
NOREF#130  -  [Pad_e114]  39.65 1.91 0 top
NOREF#131  -  [Pad_e6454]  26.8 19.68 0 top
NOREF#132  -  [Pad_e57]  49.78 6.98 0 top
NOREF#133  -  [Pad_e2012]  67.56 60.32 0 top
NOREF#134  -  [Pad_e2020]  42.15 62.86 0 top
NOREF#135  -  [Pad_e5835]  4.44 24.38 0 top
NOREF#136  -  [Pad_e1861]  72.64 1.91 0 top
NOREF#137  -  [Pad_e2015]  75.18 60.32 0 top
NOREF#138  -  [Pad_e17]  70.1 57.78 0 top
Power  SML-811UTT86C  [LED-SMD_L3.4-W1.3-RD]  24.51 47.24 0 top
R1  240Ω  [R1210]  16.64 29.59 270 top
R2  10kΩ  [R2512]  18.54 24.64 180 top
R3  330Ω  [R2010]  25.15 35.31 90 top
R4  330Ω  [R2010]  27.31 51.43 0 top
R5  390Ω  [R0805]  29.72 41.27 180 top
R6  240Ω  [R1206]  10.92 43.05 180 top
R7  330Ω  [R1206]  8.07 47.6 270 top
Rx  SML-811UTT86C  [LED-SMD_L3.4-W1.3-RD]  17.27 41.02 0 top
SCK  SML-811UTT86C  [LED-SMD_L3.4-W1.3-RD]  24.51 42.8 0 top
Tx  SML-811UTT86C  [LED-SMD_L3.4-W1.3-RD]  17.27 44.7 0 top
X1  16MHz  [HC-49US_L11.5-W4.5-P4.88]  58.68 47.18 90 top

## Footprints (pads in the part's own frame, mm; a bottom-side part is the same pattern mirrored in y, then rotated)
ANT-SMD_L3.2-W1.6
  rect 1x1.75 smd: 1(-1.578,0) 2(1.578,0)
C0805
  rect 1.41x1.35 smd: 1(-1.03,0) 2(1.03,0)
C1206
  rect 1.485x1.728 smd: 1(-1.593,0) 2(1.593,0)
C1210
  rect 1.635x2.7 smd: 1(-1.518,0) 2(1.518,0)
DC-IN-TH_694106301002
  oval 1.6x3.8 hole 0.8x3: 1(2.9,2.4) 2(-2.9,2.4)
  oval 3.8x1.6 hole 3x0.8: 3(-0.1,-2.4)
DO-41_BD2.4-L4.7-P8.70-D0.9-RD
  round 1.8 hole 1: 1(-4.35,0) 2(4.35,0)
HC-49US_L11.5-W4.5-P4.88
  rect 1.5x1.5 hole 0.9: 1(-2.44,0)
  round 1.5 hole 0.9: 2(2.44,0)
LED-SMD_L3.4-W1.3-RD
  rect 1.6x1.4 smd: 1(-1.6,0) 2(1.6,0)
Pad_e12
  round 1.778 hole 0.914: 1(0,0)
Pad_e13
  round 1.778 hole 0.914: 2(0,0)
Pad_e14
  round 1.778 hole 0.914: 3(0,0)
Pad_e15
  round 1.778 hole 0.914: 4(0,0)
Pad_e16
  round 1.778 hole 0.914: 5(0,0)
Pad_e17
  round 1.778 hole 0.914: 6(0,0)
Pad_e18
  round 1.778 hole 0.914: 7(0,0)
Pad_e19
  round 1.778 hole 0.914: 8(0,0)
Pad_e38
  round 1.778 hole 0.914: 1(0,0)
Pad_e41
  round 1.778 hole 0.914: 2(0,0)
Pad_e43
  round 1.778 hole 0.914: 3(0,0)
Pad_e45
  round 1.778 hole 0.914: 4(0,0)
Pad_e46
  round 1.778 hole 0.914: 5(0,0)
Pad_e47
  round 1.778 hole 0.914: 6(0,0)
Pad_e48
  round 1.778 hole 0.914: 7(0,0)
Pad_e49
  round 1.778 hole 0.914: 8(0,0)
Pad_e52
  round 1.778 hole 0.914: 1(0,0)
Pad_e53
  round 1.778 hole 0.914: 2(0,0)
Pad_e54
  round 1.778 hole 0.914: 3(0,0)
Pad_e55
  round 1.778 hole 0.914: 4(0,0)
Pad_e56
  round 1.778 hole 0.914: 5(0,0)
Pad_e57
  round 1.778 hole 0.914: 6(0,0)
Pad_e58
  round 1.778 hole 0.914: 7(0,0)
Pad_e59
  round 1.778 hole 0.914: 8(0,0)
Pad_e60
  round 1.778 hole 0.914: 9(0,0)
Pad_e112
  round 1.778 hole 0.914: 9(0,0)
Pad_e113
  round 1.778 hole 0.914: 9(0,0)
Pad_e114
  round 1.778 hole 0.914: 9(0,0)
Pad_e180
  round 0.003 hole 3.302: 1(0,0)
Pad_e290
  round 1.778 hole 0.914: GND(0,0)
Pad_e291
  round 1.778 hole 0.914: NC(0,0)
Pad_e336
  round 1.778 hole 0.914: 9(0,0)
Pad_e337
  round 1.778 hole 0.914: 10(0,0)
Pad_e338
  round 1.778 hole 0.914: 11(0,0)
Pad_e339
  round 1.778 hole 0.914: 12(0,0)
Pad_e340
  round 1.778 hole 0.914: 13(0,0)
Pad_e341
  round 1.778 hole 0.914: 14(0,0)
Pad_e342
  round 1.778 hole 0.914: 15(0,0)
Pad_e433
  round 1.778 hole 0.914: 1(0,0)
Pad_e434
  round 1.778 hole 0.914: 2(0,0)
Pad_e435
  round 1.778 hole 0.914: 3(0,0)
Pad_e676
  round 1.778 hole 0.914: 1(0,0)
Pad_e723
  round 1.778 hole 0.914: RX(0,0)
Pad_e725
  round 1.778 hole 0.914: RTS(0,0)
Pad_e744
  round 1.778 hole 0.914: TX(0,0)
Pad_e1557
  round 1.016 hole 0.508: TP1(0,0)
Pad_e1601
  round 1.016 hole 0.508: TP1(0,0)
Pad_e1602
  round 1.016 hole 0.508: TP1(0,0)
Pad_e1603
  round 1.016 hole 0.508: TP1(0,0)
Pad_e1604
  round 1.016 hole 0.508: TP1(0,0)
Pad_e1605
  round 1.016 hole 0.508: TP1(0,0)
Pad_e1607
  round 1.016 hole 0.508: TP1(0,0)
Pad_e1623
  round 1.016 hole 0.508: TP1(0,0)
Pad_e1832
  round 1.778 hole 0.914: 9(0,0)
Pad_e1833
  round 1.778 hole 0.914: 8(0,0)
Pad_e1834
  round 1.778 hole 0.914: 7(0,0)
Pad_e1835
  round 1.778 hole 0.914: 6(0,0)
Pad_e1836
  round 1.778 hole 0.914: 5(0,0)
Pad_e1837
  round 1.778 hole 0.914: 4(0,0)
Pad_e1838
  round 1.778 hole 0.914: 3(0,0)
Pad_e1839
  round 1.778 hole 0.914: 2(0,0)
Pad_e1840
  round 1.778 hole 0.914: 1(0,0)
Pad_e1841
  round 1.778 hole 0.914: 1(0,0)
Pad_e1842
  round 1.778 hole 0.914: 2(0,0)
Pad_e1843
  round 1.778 hole 0.914: 3(0,0)
Pad_e1844
  round 1.778 hole 0.914: 4(0,0)
Pad_e1845
  round 1.778 hole 0.914: 5(0,0)
Pad_e1846
  round 1.778 hole 0.914: 6(0,0)
Pad_e1847
  round 1.778 hole 0.914: 7(0,0)
Pad_e1848
  round 1.778 hole 0.914: 8(0,0)
Pad_e1849
  round 1.778 hole 0.914: 9(0,0)
Pad_e1850
  round 1.778 hole 0.914: 8(0,0)
Pad_e1851
  round 1.778 hole 0.914: 7(0,0)
Pad_e1852
  round 1.778 hole 0.914: 6(0,0)
Pad_e1853
  round 1.778 hole 0.914: 5(0,0)
Pad_e1854
  round 1.778 hole 0.914: 4(0,0)
Pad_e1855
  round 1.778 hole 0.914: 3(0,0)
Pad_e1856
  round 1.778 hole 0.914: 2(0,0)
Pad_e1857
  round 1.778 hole 0.914: 1(0,0)
Pad_e1858
  round 1.778 hole 0.914: 1(0,0)
Pad_e1859
  round 1.778 hole 0.914: 2(0,0)
Pad_e1860
  round 1.778 hole 0.914: 3(0,0)
Pad_e1861
  round 1.778 hole 0.914: 4(0,0)
Pad_e1862
  round 1.778 hole 0.914: 5(0,0)
Pad_e1863
  round 1.778 hole 0.914: 6(0,0)
Pad_e1864
  round 1.778 hole 0.914: 7(0,0)
Pad_e1865
  round 1.778 hole 0.914: 8(0,0)
Pad_e2004
  round 1.778 hole 0.914: 15(0,0)
Pad_e2005
  round 1.778 hole 0.914: 14(0,0)
Pad_e2006
  round 1.778 hole 0.914: 13(0,0)
Pad_e2007
  round 1.778 hole 0.914: 12(0,0)
Pad_e2008
  round 1.778 hole 0.914: 11(0,0)
Pad_e2009
  round 1.778 hole 0.914: 10(0,0)
Pad_e2010
  round 1.778 hole 0.914: 9(0,0)
Pad_e2011
  round 1.778 hole 0.914: 8(0,0)
Pad_e2012
  round 1.778 hole 0.914: 7(0,0)
Pad_e2013
  round 1.778 hole 0.914: 6(0,0)
Pad_e2014
  round 1.778 hole 0.914: 5(0,0)
Pad_e2015
  round 1.778 hole 0.914: 4(0,0)
Pad_e2016
  round 1.778 hole 0.914: 3(0,0)
Pad_e2017
  round 1.778 hole 0.914: 2(0,0)
Pad_e2018
  round 1.778 hole 0.914: 1(0,0)
Pad_e2019
  round 1.778 hole 0.914: 15(0,0)
Pad_e2020
  round 1.778 hole 0.914: 14(0,0)
Pad_e2021
  round 1.778 hole 0.914: 13(0,0)
Pad_e2022
  round 1.778 hole 0.914: 12(0,0)
Pad_e2023
  round 1.778 hole 0.914: 11(0,0)
Pad_e2024
  round 1.778 hole 0.914: 10(0,0)
Pad_e2025
  round 1.778 hole 0.914: 9(0,0)
Pad_e2026
  round 1.778 hole 0.914: 8(0,0)
Pad_e2027
  round 1.778 hole 0.914: 7(0,0)
Pad_e2028
  round 1.778 hole 0.914: 6(0,0)
Pad_e2029
  round 1.778 hole 0.914: 5(0,0)
Pad_e2030
  round 1.778 hole 0.914: 4(0,0)
Pad_e2031
  round 1.778 hole 0.914: 3(0,0)
Pad_e2032
  round 1.778 hole 0.914: 2(0,0)
Pad_e2033
  round 1.778 hole 0.914: 1(0,0)
Pad_e4615
  round 1.778 hole 0.914: GND(0,0)
Pad_e4616
  round 1.778 hole 0.914: GND(0,0)
Pad_e4617
  round 1.778 hole 0.914: 3V3(0,0)
Pad_e4618
  round 1.778 hole 0.914: 5V(0,0)
Pad_e4619
  round 1.778 hole 0.914: VIN(0,0)
Pad_e5831
  round 1.016 hole 0.508: TP1(0,0)
Pad_e5832
  round 1.016 hole 0.508: TP1(0,0)
Pad_e5833
  round 1.016 hole 0.508: TP1(0,0)
Pad_e5834
  round 1.016 hole 0.508: TP1(0,0)
Pad_e5835
  round 1.016 hole 0.508: TP1(0,0)
Pad_e5836
  round 1.016 hole 0.508: TP1(0,0)
Pad_e6450
  round 0.003 hole 3.302: 1(0,0)
Pad_e6454
  round 0.003 hole 3.302: 1(0,0)
Pad_e6891
  round 1.016 hole 0.61: TP3(0,0)
Pad_e6892
  round 1.016 hole 0.61: TP4(0,0)
Pad_e7903
  round 1.016 hole 0.508: TP1(0,0)
Pad_e7904
  round 1.016 hole 0.508: TP1(0,0)
Pad_e8725
  round 0.003 hole 3.302: 1(0,0)
Pad_e9009
  round 1.016 hole 0.508: TP1(0,0)
Pad_e9016
  round 1.016 hole 0.508: TP1(0,0)
Pad_e9017
  round 1.016 hole 0.508: TP1(0,0)
PDIP-40_L52.3-W13.8-P2.54-LS15.2-BL
  rect 1.8x1.8 hole 1: 1(-24.13,-7.62)
  round 1.8 hole 1: 2(-21.59,-7.62) 3(-19.05,-7.62) 4(-16.51,-7.62) 5(-13.97,-7.62) 6(-11.43,-7.62) 7(-8.89,-7.62) 8(-6.35,-7.62) 9(-3.81,-7.62) 10(-1.27,-7.62) 11(1.27,-7.62) 12(3.81,-7.62) 13(6.35,-7.62) 14(8.89,-7.62) 15(11.43,-7.62) 16(13.97,-7.62) 17(16.51,-7.62) 18(19.05,-7.62) 19(21.59,-7.62) 20(24.13,-7.62) 21(24.13,7.62) 22(21.59,7.62) 23(19.05,7.62) 24(16.51,7.62) 25(13.97,7.62) 26(11.43,7.62) 27(8.89,7.62) 28(6.35,7.62) 29(3.81,7.62) 30(1.27,7.62) 31(-1.27,7.62) 32(-3.81,7.62) 33(-6.35,7.62) 34(-8.89,7.62) 35(-11.43,7.62) 36(-13.97,7.62) 37(-16.51,7.62) 38(-19.05,7.62) 39(-21.59,7.62) 40(-24.13,7.62)
R0805
  rect 1.133x1.377 smd: 1(-1,0) 2(1,0)
R1206
  rect 1.2x1.9 smd: 1(-1.6,0) 2(1.6,0)
R1210
  rect 1.282x2.808 smd: 1(-1.441,0) 2(1.441,0)
R2010
  rect 1.282x2.7 smd: 1(-2.391,0) 2(2.391,0)
R2512
  rect 1.282x3.456 smd: 1(-3.067,0) 2(3.067,0)
SW-TH_4P-L6.0-W6.0-P4.50-LS6.5
  round 1.8 hole 1.2: 1(-3.25,2.25) 2(3.25,2.25) 3(-3.25,-2.25) 4(3.25,-2.25)
TO-220-3_L10.2-W4.6-P2.54-L
  rect 2x1.5 hole 1.4x0.8: 1(-2.54,0)
  oval 2x1.5 hole 1.4x0.8: 2(0,0) 3(2.54,0)
TO-220IS_L10.16-W4.7-P2.54-L
  rect 2x2.5 hole 1.3: 1(-2.54,0)
  oval 2x2.5 hole 1.3: 2(0,0) 3(2.54,0)

## Nets
3V3: C3.1 IC3.1 NOREF#101.3V3 R1.1
5V: C2.2 C10.2 IC2.3 NOREF#56.1
5VUSB: NOREF#12.3 NOREF#50.1
AVCC: C9.1 FB1.2 IC1.30
VCC: C8.1 FB1.1 IC1.10 NOREF#2.1 NOREF#4.2 NOREF#5.TP4 NOREF#10.3 NOREF#13.7 NOREF#24.2 NOREF#25.9 NOREF#34.5 NOREF#35.3 NOREF#37.10 NOREF#40.14 NOREF#41.15 NOREF#43.6 NOREF#44.6 NOREF#54.13 NOREF#58.11 NOREF#59.1 NOREF#63.4 NOREF#66.9 NOREF#67.2 NOREF#68.5V NOREF#75.4 NOREF#83.8 NOREF#87.8 NOREF#89.6 NOREF#90.2 NOREF#98.5 NOREF#102.12 NOREF#108.7 NOREF#113.8 NOREF#114.1 NOREF#115.9 NOREF#116.3 NOREF#117.TP3 NOREF#128.5 NOREF#133.7 NOREF#137.4 R4.2 R5.2 Rx.2 Tx.2
AREF: C11.1 IC1.32 NOREF#96.1
GROUND: B1.3 B1.4 C1.1 C2.1 C3.2 C4.2 C5.2 C7.1 C8.2 C9.2 C10.1 C11.2 IC1.11 IC1.31 IC2.2 JACK1.2 JACK1.3 NOREF#3.5 NOREF#6.3 NOREF#7.7 NOREF#8.1 NOREF#11.12 NOREF#18.TP1 NOREF#19.6 NOREF#20.6 NOREF#22.8 NOREF#26.TP1 NOREF#28.9 NOREF#30.TP1 NOREF#31.1 NOREF#32.TP1 NOREF#33.TP1 NOREF#38.11 NOREF#39.GND NOREF#45.TP1 NOREF#47.3 NOREF#48.4 NOREF#51.1 NOREF#57.5 NOREF#64.7 NOREF#69.6 NOREF#70.8 NOREF#71.2 NOREF#73.TP1 NOREF#74.2 NOREF#80.2 NOREF#81.TP1 NOREF#84.10 NOREF#92.GND NOREF#93.8 NOREF#97.7 NOREF#99.TP1 NOREF#100.4 NOREF#104.TP1 NOREF#105.5 NOREF#107.13 NOREF#109.TP1 NOREF#110.3 NOREF#111.TP1 NOREF#112.1 NOREF#118.TP1 NOREF#119.1 NOREF#120.GND NOREF#123.TP1 NOREF#126.15 NOREF#127.TP1 NOREF#129.9 NOREF#130.9 NOREF#131.1 NOREF#134.14 NOREF#135.TP1 NOREF#136.4 Power.1 R2.1 SCK.1
POWER: Power.2 R4.1
XTAL1: C5.1 IC1.13 X1.2
XTAL2: C4.1 IC1.12 X1.1

Pads without a net: B1 1 2; C1 2; C6 1 2; C7 2; D1 1 2; IC1 1 2 3 4 5 6 7 8 9 14 15 16 17 18 19 20 21 22 23 24 25 26 27 28 29 33 34 35 36 37 38 39 40; IC2 1; IC3 2 3; JACK1 1; NOREF 1; NOREF#9 4; NOREF#14 4; NOREF#15 TP1; NOREF#16 3; NOREF#17 7; NOREF#21 15; NOREF#23 5; NOREF#27 3; NOREF#29 5; NOREF#36 TX; NOREF#42 3; NOREF#46 8; NOREF#49 NC; NOREF#52 RTS; NOREF#53 1; NOREF#55 2; NOREF#60 7; NOREF#61 VIN; NOREF#62 TP1; NOREF#65 6; NOREF#72 2; NOREF#76 RX; NOREF#77 13; NOREF#78 12; NOREF#79 4; NOREF#82 9; NOREF#85 2; NOREF#86 TP1; NOREF#88 1; NOREF#91 14; NOREF#94 10; NOREF#95 9; NOREF#103 8; NOREF#106 7; NOREF#121 5; NOREF#122 9; NOREF#124 8; NOREF#125 11; NOREF#132 6; NOREF#138 6; R1 2; R2 2; R3 1 2; R5 1; R6 1 2; R7 1 2; Rx 1; SCK 2; Tx 1

## Routing (per net, layer and track width the routed paths; a pad name or vN(x,y) marks a point on that pad's centre or on a via; arc(x,y) is an arc through that point)
3V3: length 23.2
  Top Layer w0.762: IC3.1 12.83,28.32 15.54,31.03 R1.1
  Top Layer w0.889: NOREF#101.3V3 3.94,27.05 C3.1 10.54,32.9 IC3.1
5V: length 49.9
  Top Layer w0.889: 23.8,13.97 23.8,9.82 C2.2 25.27,9.14 27.12,10.99 C10.2 28.32,12.01 32.11,15.79 32.11,19.93 26.09,25.95 24.84,25.95 19.85,30.93 19.85,32.89 15.53,37.21 NOREF#56.1
5VUSB: length 9.5
  Top Layer w0.762: NOREF#50.1 1.78,44.45 6.98,39.24 NOREF#12.3
AVCC: length 32.4
  Top Layer w0.762: FB1.2 31.97,27.36 32.05,27.43 56.51,27.43 57.4,26.54 IC1.30 57.59,24.58 C9.1
VCC: length 243.3
  Top Layer w0.508: R4.2 29.36,51.1 29.36,41.92 R5.2 ; 16.12,38.63 16.48,38.63 Rx.2 Tx.2
  Top Layer w0.762: 19.86,34.89 26.2,34.89 NOREF#5.TP4 28.85,37.55 28.85,41.41 ; 19.86,34.89 20.88,33.88 20.88,31.57 25.53,26.92 26.8,26.92 29.52,24.2 FB1.1 29.98,23.45 33.08,20.34 33.08,10.6 ; 19.86,34.89 16.12,38.63 10.95,38.63 NOREF#67.2 ; 33.08,10.48 39.12,4.44 NOREF#115.9
  Top Layer w0.889: NOREF#41.15 NOREF#40.14 NOREF#54.13 NOREF#102.12 NOREF#58.11 NOREF#37.10 NOREF#25.9 56.6,60.32 59.78,57.15 62.71,57.15 62.74,57.12 ; NOREF#59.1 NOREF#90.2 NOREF#10.3 NOREF#137.4 NOREF#98.5 NOREF#44.6 NOREF#133.7 NOREF#87.8 62.74,58.04 62.74,57.12 ; 62.74,57.12 62.74,52.4 64.92,50.22 64.92,45.4 62.74,43.21 C8.1 61.97,42.48 arc(61.56,42.4) 61.21,42.16 60.57,41.52 arc(60.11,40.83) IC1.10 ; NOREF#68.5V 3.05,29.59 9.52,36.07 NOREF#67.2 ; NOREF#113.8 NOREF#13.7 NOREF#43.6 NOREF#34.5 NOREF#75.4 NOREF#35.3 NOREF#4.2 NOREF#2.1 NOREF#114.1 NOREF#24.2 NOREF#116.3 NOREF#63.4 NOREF#128.5 NOREF#89.6 NOREF#108.7 NOREF#83.8 NOREF#66.9 NOREF#115.9
  Top Layer w1.016: IC1.10 59.94,36.83 58.42,35.31 NOREF#117.TP3
  Bottom Layer w0.508: NOREF#117.TP3 29.81,36.72 NOREF#5.TP4
(no net): length 998
  Top Layer w0.508: Rx.1 13.64,43.05 R6.1 ; C6.2 2.41,58.04 NOREF#52.RTS ; 12.48,54.2 31.88,54.2 31.88,38.61 33.51,36.98 50.06,36.98 50.06,39.73 IC1.14 ; 12.48,54.2 12.83,53.85 12.83,51.56 10.34,49.07 8.2,49.07 R7.1 ; 12.48,54.2 12.12,53.85 5.21,53.85 3.68,52.32 1.87,52.32 NOREF#36.TX ; Tx.1 14.38,46 R7.2 ; NOREF#15.TP1 7.47,51.29 6.35,50.16 6.35,44.2 7.49,43.05 R6.2 ; IC1.9 62.61,39.88 62.61,35.94 60.71,34.04 30.82,34.04 30.23,34.63 30.23,36.07 30.99,36.83 30.99,53.47 21.46,53.47 20.53,52.54 17.45,52.54 ; IC1.15 47.24,38.1 47.14,37.99 33.89,37.99 32.77,39.12 32.77,54.86 11.81,54.86 10.42,56.26 NOREF#86.TP1 5.31,56.26 3.91,54.86 NOREF#76.RX ; NOREF#62.TP1 C6.1
  Top Layer w0.762: NOREF#17.7 80.26,15.75 ; IC3.3 10.98,23.24 C7.2 11.33,19.18 D1.1 ; IC3.2 14.33,25.78 R2.2 15.48,26.99 R1.2 ; 82.8,14.48 84.84,16.51 84.84,19.56 82.8,21.59 IC1.40 ; R3.2 26.11,38.66 SCK.2 ; IC1.39 80.26,20.07 79.5,19.3 79.5,16.64 80.26,15.87 ; IC1.8 65.02,35.94 57.78,28.7 29.36,28.7 R3.1 ; NOREF#103.8 82.8,14.35
  Top Layer w0.889: 57.4,16.13 52.32,21.21 IC1.28 ; IC1.24 42.16,19.56 47.24,14.48 ; NOREF#132.6 49.78,14.6 ; 59.94,16.26 54.86,21.34 IC1.29 ; 75.18,24.64 NOREF#23.5 ; IC1.20 34.54,41.53 39.75,46.74 39.75,57.65 NOREF#21.15 ; IC1.25 44.7,19.81 49.78,14.73 ; NOREF#82.9 42.16,13.59 ; IC1.16 44.7,41.91 49.78,46.99 49.78,57.77 NOREF#125.11 ; 42.16,13.72 37.08,18.8 IC1.22 ; JACK1.1 14.22,10.67 14.22,13.85 13.59,14.48 5.05,14.48 D1.2 ; 54.86,15.37 49.78,20.45 IC1.27 ; D1.1 10.93,18.03 13.22,15.75 14.48,15.75 16.26,13.97 18.72,13.97 18.72,11.61 17.53,10.41 C1.2 ; IC1.17 42.16,41.91 47.24,46.99 47.24,54.3 47.23,54.31 NOREF#78.12 ; IC1.1 NOREF#88.1 ; 39.65,13.56 34.54,18.67 IC1.21 ; NOREF#94.10 52.31,47.11 47.24,42.04 IC1.15 ; IC1.8 65.02,44.02 66.17,45.17 66.17,50.45 65.02,51.59 NOREF#124.8 ; NOREF#46.8 44.7,13.97 ; NOREF#106.7 IC1.7 ; 44.7,14.1 39.5,19.3 39.5,24.64 IC1.23 ; IC1.4 NOREF#9.4 ; NOREF#91.14 42.15,53.57 42.29,53.43 42.29,46.86 37.08,41.66 IC1.19 ; NOREF#27.3 70.1,24.64 ; 52.32,15.24 47.24,20.32 IC1.26 ; NOREF#79.4 72.64,24.64 ; IC1.5 NOREF#121.5 ; IC1.2 NOREF#55.2 ; 39.65,13.43 NOREF#122.9 ; NOREF#138.6 IC1.6 ; NOREF#95.9 54.85,47.26 49.78,42.19 IC1.14 ; NOREF#42.3 57.4,16 ; NOREF#65.6 77.72,24.64 ; NOREF#60.7 47.24,14.35 ; NOREF#72.2 59.94,16.13 ; IC1.3 NOREF#16.3 ; IC1.18 39.62,41.66 44.69,46.73 NOREF#77.13 ; NOREF#14.4 54.86,15.24 ; NOREF#53.1 65.02,24.64 ; NOREF#29.5 52.32,15.11 ; NOREF#85.2 67.56,24.64
  Bottom Layer w0.762: NOREF#86.TP1 7.62,51.31 NOREF#15.TP1 ; NOREF#62.TP1 17.45,55.45 17.45,52.54
  Bottom Layer w0.889: JACK1.1 6.48,18.13 6.48,29.72 3.94,32.25 2.03,32.25 NOREF#61.VIN
AREF: length 21
  Top Layer w0.762: C11.1 63.78,15.43 63.9,15.31
  Top Layer w0.889: 62.48,24.64 62.48,21.84 63.9,20.43 63.9,8.4 NOREF#96.1
GROUND: length 358
  Top Layer w0.508: 6.1,52.83 8.92,52.83 ; 17.45,48.04 22.12,48.04 Power.1 SCK.1 ; NOREF#123.TP1 NOREF#111.TP1 ; NOREF#33.TP1 6.6,15.87 NOREF#109.TP1 ; NOREF#45.TP1 9.09,55.12
  Top Layer w0.762: NOREF#127.TP1 5.71,26.16 4.95,26.16 ; C3.2 13.33,33.15 17.65,33.15 18.87,31.93 18.87,30.53 21.61,27.79 R2.1 21.61,22.56 C7.1 21.13,16.27 IC2.2 ; NOREF#18.TP1 7.87,24.38 NOREF#135.TP1 ; C11.2 61.72,20.39 C9.2 ; NOREF#99.TP1 NOREF#32.TP1
  Top Layer w0.889: C1.1 C2.1 26.62,6.1 C10.1 ; C8.2 62.74,46.15 63.88,47.29 63.88,49.2 63.53,49.55 63.37,49.55 C4.2 62.61,50.67 NOREF#30.TP1 59.7,53.58 C5.2 ; 60.2,22.17 60.2,24.51 IC1.31
  Bottom Layer w0.889: JACK1.2 11.08,7.73 11.08,5.73 19.95,5.73 NOREF#26.TP1 20.32,9.52 21.13,10.34 IC2.2 ; 61.02,52.13 61.85,51.31 61.85,44.45 IC1.11 57.4,36.07 59.94,33.53 IC1.31 ; 17.71,47.6 6,47.6 5.11,48.49 ; 5.11,48.49 3.94,49.66 1.65,49.66 ; 5.11,48.49 5.11,51.84 6.1,52.83 6.1,54.86 NOREF#45.TP1 ; NOREF#120.GND NOREF#92.GND ; NOREF#30.TP1 61.09,58.42 62.36,59.69 62.36,62.24 62.99,62.86 ; 62.99,62.86 NOREF#70.8 NOREF#7.7 NOREF#20.6 NOREF#57.5 NOREF#48.4 NOREF#110.3 NOREF#74.2 NOREF#112.1 ; 62.99,62.86 NOREF#129.9 NOREF#84.10 NOREF#38.11 NOREF#11.12 NOREF#107.13 NOREF#134.14 NOREF#126.15 38.35,62.86 37.21,61.72 37.21,58.55 26.7,48.04 17.45,48.04 21.08,44.4 21.08,34.33 34.54,20.87 34.54,10.16 37.08,10.16 37.71,9.53 37.71,2.3 38.1,1.91 NOREF#130.9 NOREF#28.9 NOREF#93.8 NOREF#97.7 NOREF#69.6 NOREF#105.5 NOREF#100.4 NOREF#6.3 NOREF#80.2 NOREF#119.1 NOREF#51.1 NOREF#71.2 NOREF#47.3 NOREF#136.4 NOREF#3.5 NOREF#19.6 NOREF#64.7 NOREF#22.8
POWER: length 4.7
  Top Layer w0.508: R4.1 26.11,50.24 Power.2
XTAL1: length 17.3
  Top Layer w0.889: C5.1 57.64,50.66 X1.2 52.32,43.26 IC1.13
XTAL2: length 11.7
  Top Layer w0.889: C4.1 62.19,48.25 X1.1 54.86,40.92 IC1.12

## Copper pours and planes (outline as drawn; the poured copper is in the pictures)
GROUND on Bottom Layer: 85.98,0 0.38,0 0.38,64.52 85.98,64.52

## Text on the board
Bottom Silkscreen Layer: Revision 2 / ATMEGA1284 / FrogDuino | FROGTRONICS
Top Silkscreen Layer: 5V Switch / <-USB-JACK-> | GND | RTS | RX | TX | 5V | Ground Line | 5V Line | D15 | D16 | D17 | D18 | D19 | D20 | D21 | D22 | D23 | AREF | A7 | A6 | A5 | A4 | A3 | A2 | A1 | A0 | D14 | D13 | D12 | D11 | D10 | D9 | D8 | D7 | D6 | D5 | D4 | D2 | D1 | D0 | 3V3 | D3 | VIN | Please give credit to Evan Dueck / If you use it can you / dm me (Froggy814) on forum.arduino.com | 7-16V Max | FrogDuino R2
